# EAGLE design usbid-switch (EAGLE 9.2.0)
AUTHOR: w. boyett; CONTACT_ADDRESS: github.com/watsonboyett; CONTACT_COMPANY: Make Time Club; CONTACT_PHONE: Licensed under CC-BY-SA; REV: 1A
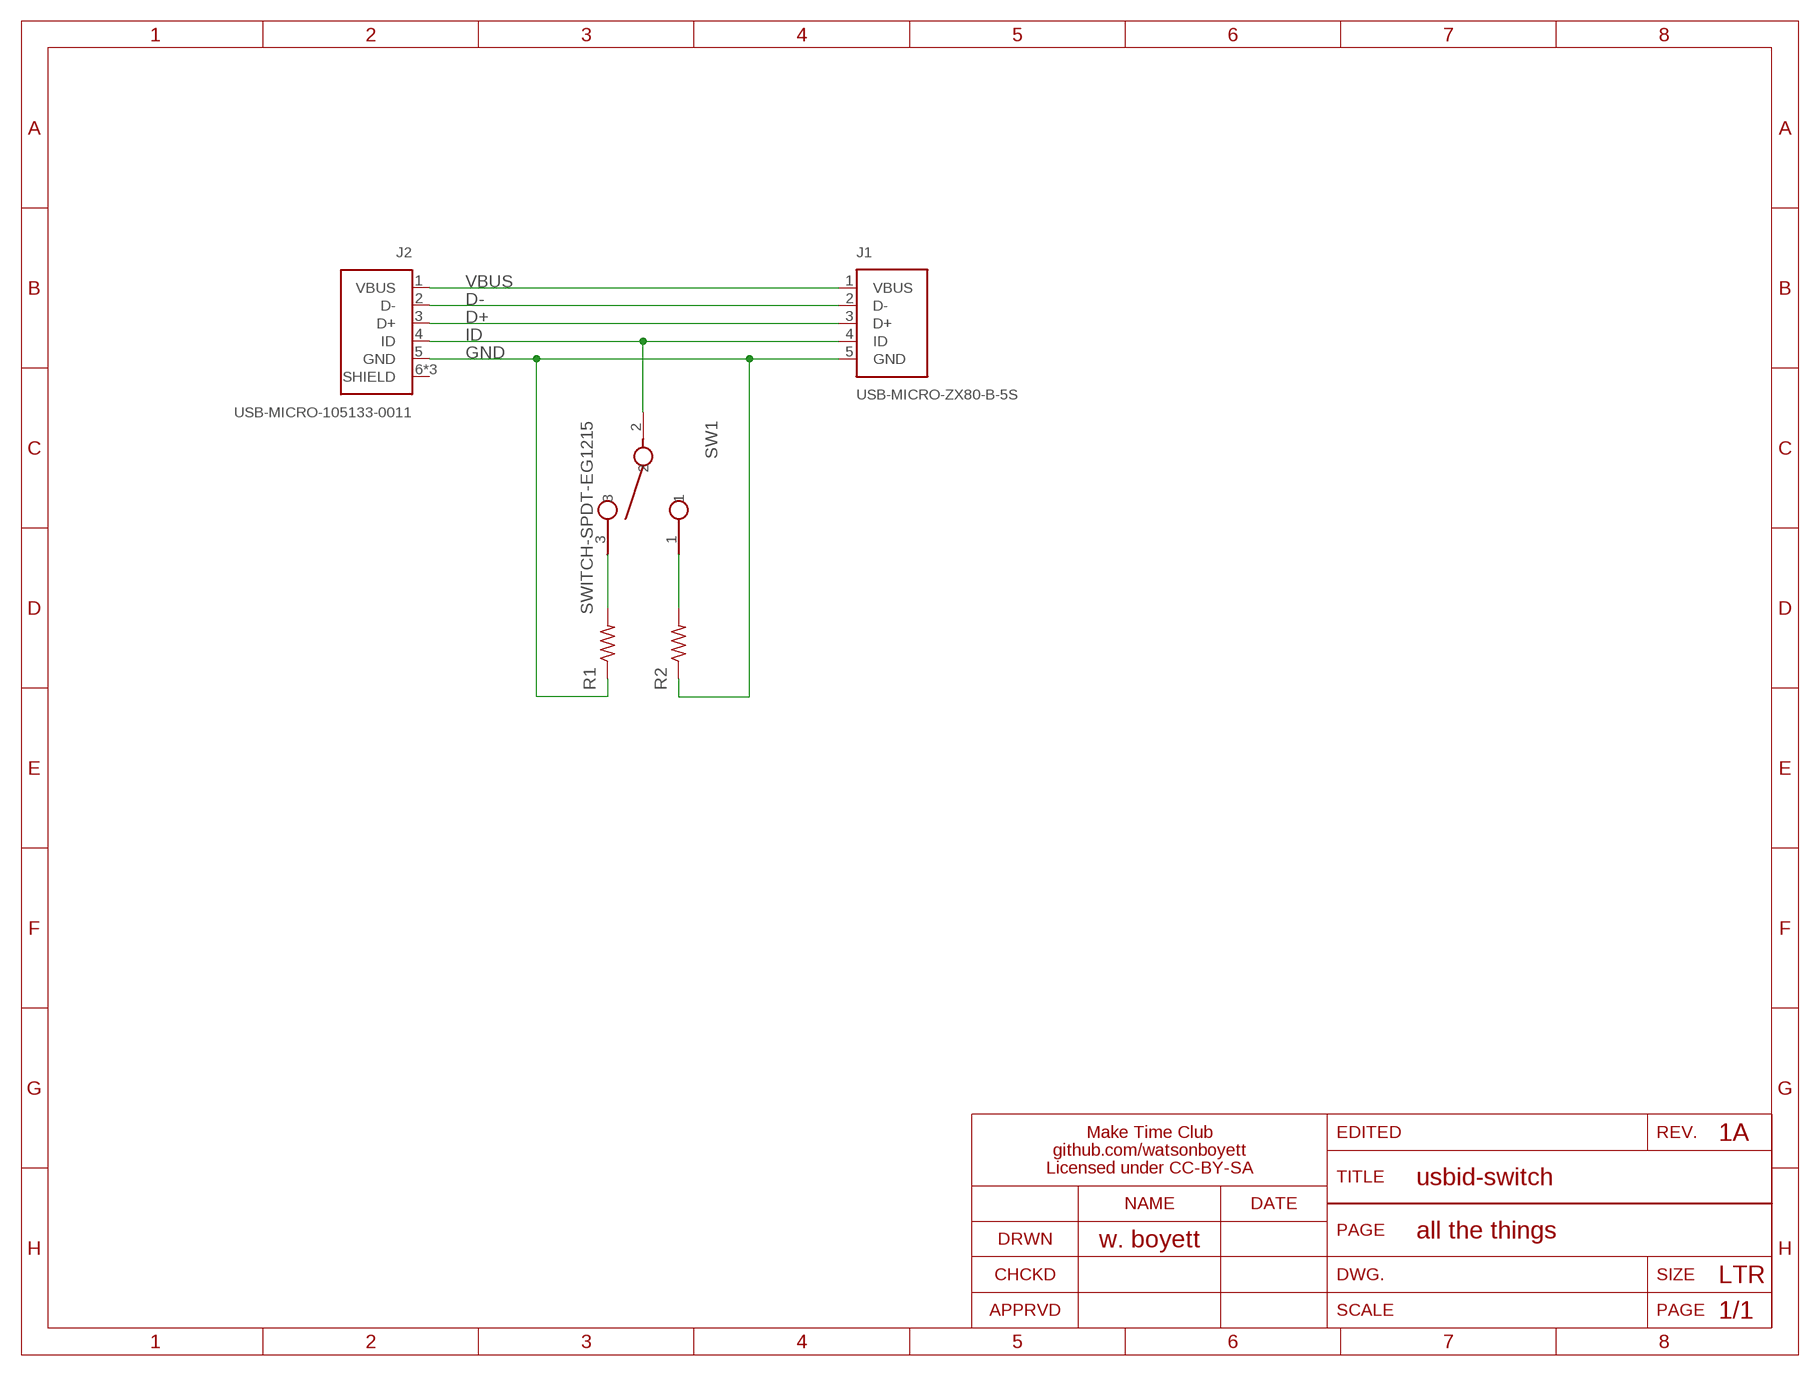
[diagram p0: schematic, sheet 1]
FRAME1 (LETTER_L): SECTION: all the things

## Parts
J1  USB-MICRO-ZX80-B-5S  [HRS_ZX80-B-5S]
J2  USB-MICRO-105133-0011  [MOLEX_105133-0011]
R1  R-US_R0603  [R0603]
R2  R-US_R0603  [R0603]
SW1  SWITCH-SPDT-EG1215  [EG1215]

## Nets
D+: J1.3(D+) J2.3(D+)
D-: J1.2(D-) J2.2(D-)
GND: J1.5(GND) J2.5(GND) R1.1 R2.1
ID: J1.4(ID) J2.4(ID) SW1.2
N$6: R1.2 SW1.3
N$7: R2.2 SW1.1
VBUS: J1.1(VBUS) J2.1(VBUS)
Unconnected: J2.6(SHIELD) J2.7(SHIELD) J2.8(SHIELD)

## Library data of the parts
J1 = gametroller:USB-MICRO-ZX80-B-5S: Conn Micro USB 2.0 Type B PL 5 POS 0.65mm Solder ST SMD 5 Terminal 1 Port; MFG: Hirose; MPN: ZX80-B-5S; PN-DK: H125281-ND‎
J2 = gametroller:USB-MICRO-105133-0011: Conn Micro USB Type B RCP 5 POS 0.65mm Solder ST SMD 5 Terminal 1 Port Embossed T/R; MFG: Molex; MPN: 1051330011; PN-DK: WM9734CT-ND
R1 R2 = gametroller:R-US_: RESISTOR, American symbol
SW1 = gametroller:SWITCH-SPDT: Switch Slide ON ON SPDT Side Slide 0.1A 12VDC 1.2VA 10000Cycles Gull Wing SMD T/R; MFG: E-Switch; MPN: EG1215AA; PN-DK: EG5720CT-ND

## Board
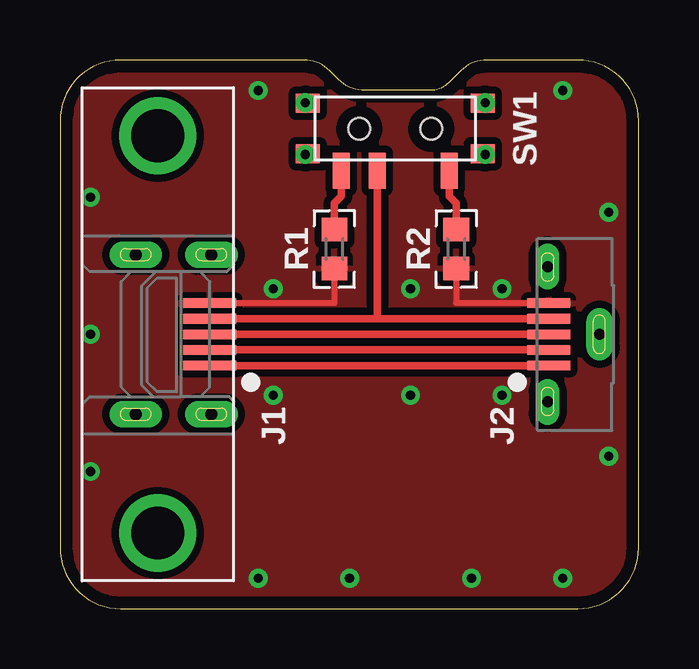
[diagram p1: board, top side]
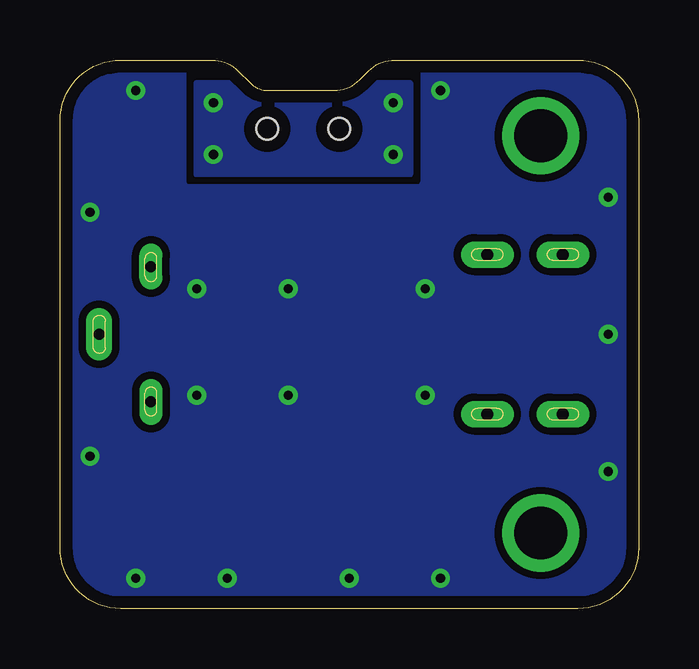
[diagram p2: board, bottom side, seen from below]

Size 24.11 x 22.86 mm. Coordinates in mm from the lower left corner, seen from the top.
Outline: 2.54,0 21.57,0 arc90 24.11,2.54 24.11,20.32 arc90 21.57,22.86 17.78,22.86 arc45 16.7,22.41 16.19,21.91 arc-45 15.43,21.59 12.7,21.59 arc-45 11.62,22.04 11.24,22.41 arc45 10.16,22.86 2.54,22.86 arc90 0,20.32 0,2.54 arc90 2.54,0
Copper layers (1*16): Top 0.035mm / dielectric 1.5mm / Bottom 0.035mm
Design rules "default *": minimum track width 10mil, minimum drill 15mil, track to track 8mil, track to pad 8mil, pad to pad 8mil, via to via 8mil, smd to smd 8mil, copper to edge 20mil, drill to drill 6mil, minimum pad ring 10mil, minimum via ring 8mil, stop-mask expansion 4mil, vias tented up to drill 20mil, thermal gap 10mil

### Footprints (pad centres in the part's own frame; a part is rotated, then mirrored left to right if it is on the bottom)
HRS_ZX80-B-5S = smd 0.4 x 2.2: 1 -1.3,-1.8; 2 -0.65,-1.8; 3 0,-1.8; 4 0.65,-1.8; 5 1.3,-1.8 | drill 2.2: P$1 -8.275,0.37; P$2 8.275,0.37 | drill 0.5 pad 1.1 long: P$3 -3.325,1.29; P$4 3.325,1.29; P$5 -3.325,-1.86; P$6 3.325,-1.86
MOLEX_105133-0011 = smd 0.4 x 1.8: 1 -1.3,1.23; 2 -0.65,1.23; 3 0,1.23; 4 0.65,1.23; 5 1.3,1.23 | drill 0.457 pad 1.092 long: 6 0,-0.889 | drill 0.457 pad 0.94 long: 7 -2.819,1.27; 8 2.819,1.27
R0603 = smd 0.965 x 1.067: 1 -0.813,0; 2 0.813,0
EG1215 = smd 0.7 x 1.5: 1 -2.25,1.75; 2 0.75,1.75; 3 2.25,1.75 | smd 1 x 0.8: S1 -3.65,1.05; S2 -3.65,-1.05; S3 3.65,1.05; S4 3.65,-1.05 | hole 0.9: -1.5,0; 1.5,0

### Placement (x,y rotation side)
J1  4.45,11.43 90 top
J2  21.59,11.43 90 top
R1  11.43,14.99 90 top
R2  16.51,14.99 90 top
SW1  13.97,20 180 top

### Tracks (layer width: path | path; a pad name or v marks a point on that pad's centre or on a via)
D+
  Top 0.305: J2.3 J1.3
D-
  Top 0.305: J2.2 J1.2
GND  (via drill 0.38)
  Top 0.254: J1.5 11.43,12.73 R1.1 | J2.5 16.51,12.73 R2.1
  other vias: 14.61,13.34 18.41,13.34 8.89,13.34 1.27,17.14 1.27,5.71 1.27,11.43 22.86,16.51 22.86,6.35 8.26,21.59 20.95,21.59 8.26,1.27 12.06,1.27 17.14,1.27 20.95,1.27 14.61,8.89 8.89,8.89 18.41,8.89
  pour Top (isolate 0.305, rank 3): 0.64,22.23 0.64,0.64 23.5,0.64 23.5,22.23
  pour Bottom (isolate 0.305, rank 3): 0.64,22.23 0.64,0.64 23.5,0.64 23.5,22.23
ID
  Top 0.254: 13.22,12.09 13.21,12.08
  Top 0.305: J1.4 13.21,12.08 J2.4 | SW1.2 13.22,12.09
N$6
  Top 0.305: R1.2 11.43,16.89 11.72,17.18 SW1.3
N$7
  Top 0.305: R2.2 16.51,16.89 16.22,17.18 SW1.1
SW1-MS  (via drill 0.38)
  other vias: 10.22,21.08 10.22,18.92 17.72,18.92 17.72,21.08
  pour Bottom: 9.53,21.91 9.53,18.1 18.41,18.1 18.41,21.91
  pour Bottom: 9.53,21.91 9.53,18.1 18.41,18.1 18.41,21.91
VBUS
  Top 0.305: J2.1 J1.1